# EAGLE design HVAC8New (EAGLE 7.2.0)
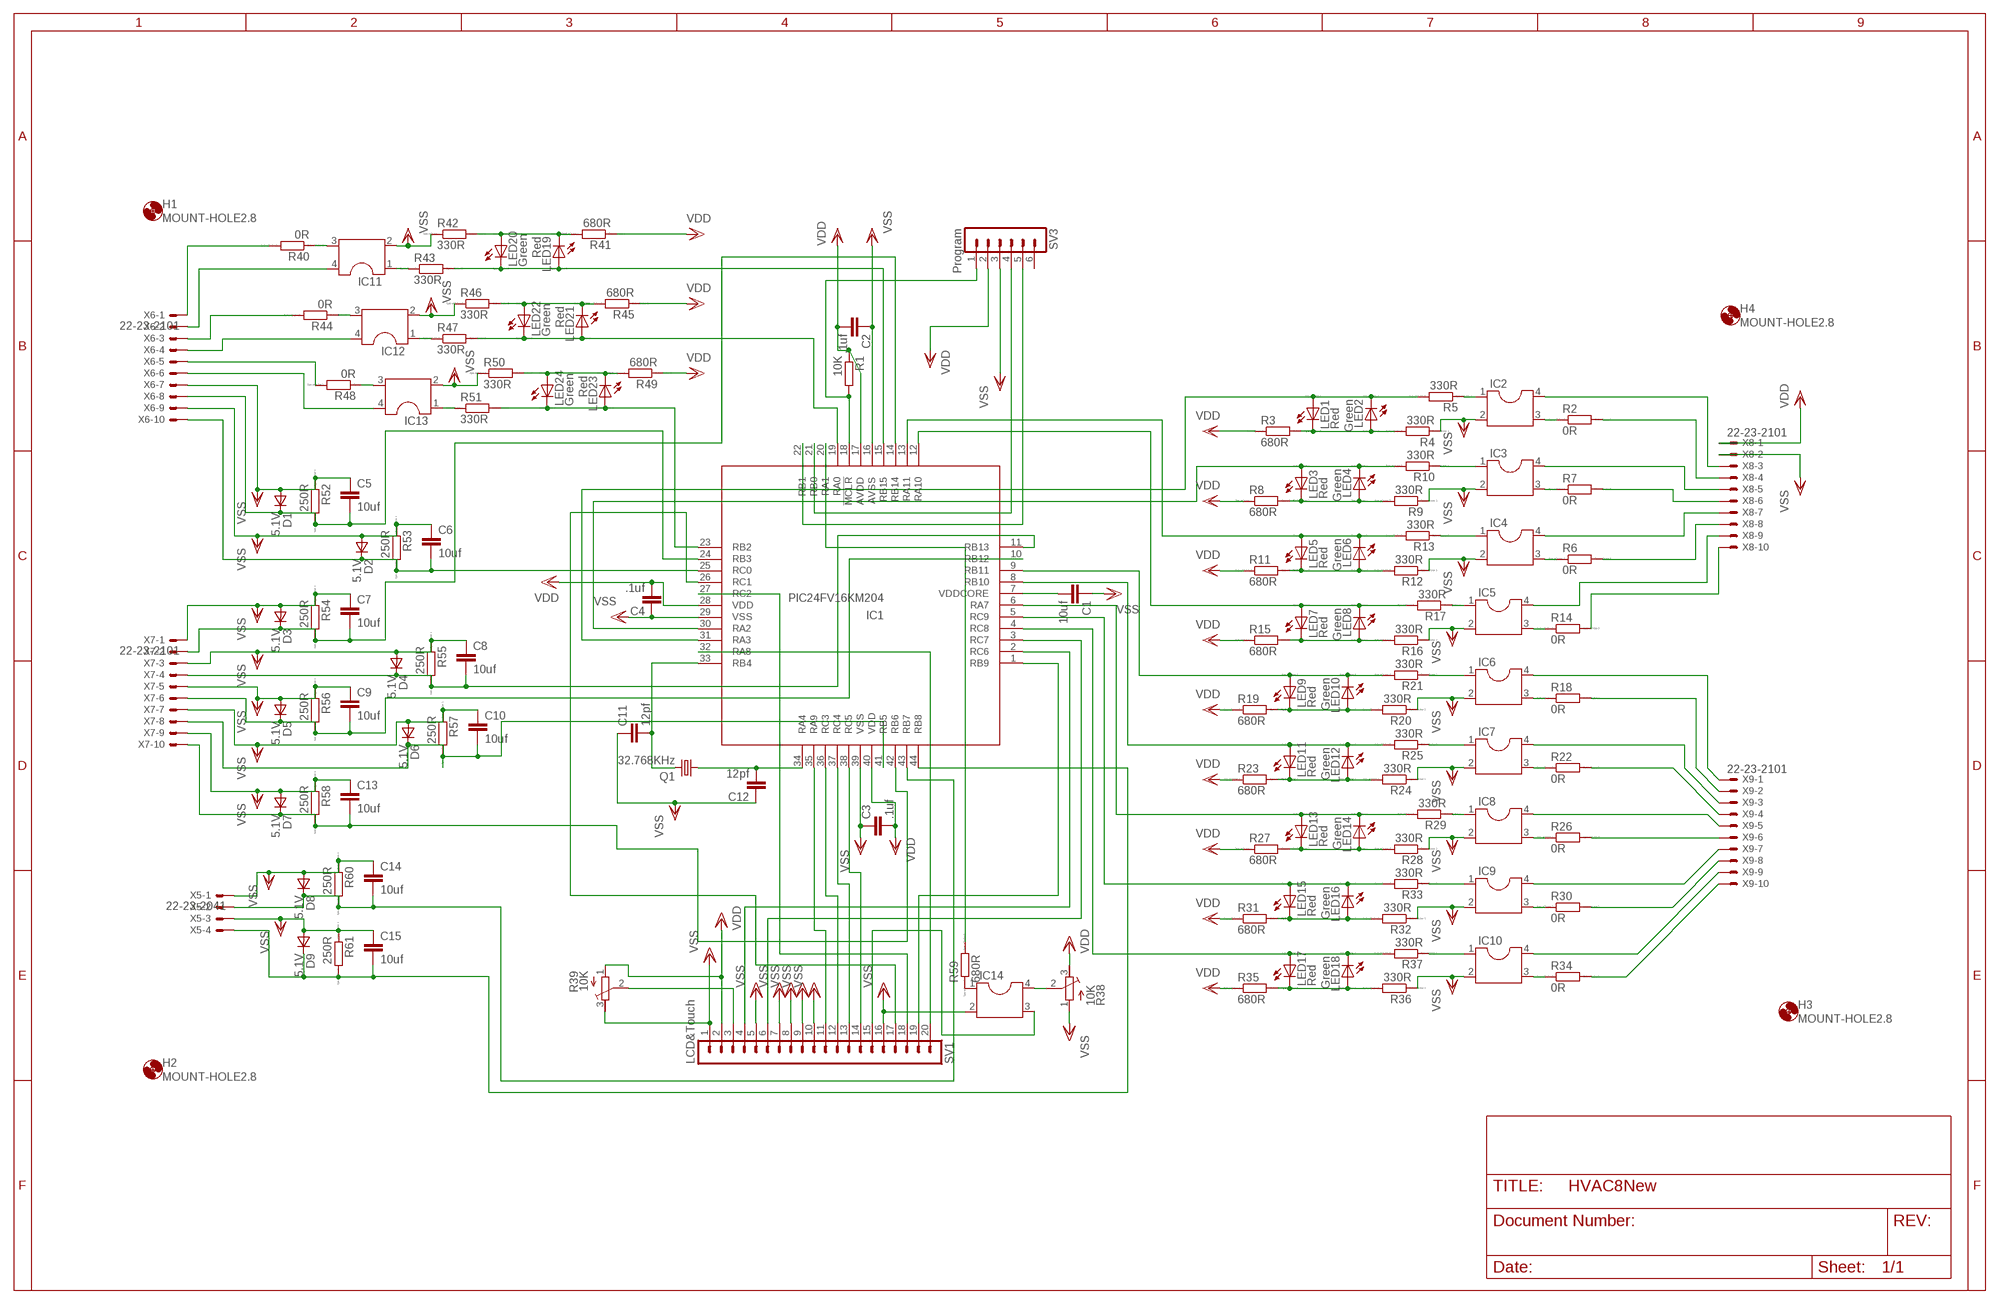
[diagram p0: schematic, sheet 1]

## Parts
C1  10uf  C-EUC1206  [C1206]
C2  .1uf  C-EUC1206  [C1206]
C3  .1uf  C-EUC1206  [C1206]
C4  .1uf  C-EUC1206  [C1206]
C5  10uf  C-EUC1206  [C1206]
C6  10uf  C-EUC1206  [C1206]
C7  10uf  C-EUC1206  [C1206]
C8  10uf  C-EUC1206  [C1206]
C9  10uf  C-EUC1206  [C1206]
C10  10uf  C-EUC1206  [C1206]
C11  12pf  C-EUC0603  [C0603]
C12  12pf  C-EUC0603  [C0603]
C13  10uf  C-EUC1206  [C1206]
C14  10uf  C-EUC1206  [C1206]
C15  10uf  C-EUC1206  [C1206]
D1  5.1V  DSOD323  [SOD323]
D2  5.1V  DSOD323  [SOD323]
D3  5.1V  DSOD323  [SOD323]
D4  5.1V  DSOD323  [SOD323]
D5  5.1V  DSOD323  [SOD323]
D6  5.1V  DSOD323  [SOD323]
D7  5.1V  DSOD323  [SOD323]
D8  5.1V  DSOD323  [SOD323]
D9  5.1V  DSOD323  [SOD323]
H1  MOUNT-HOLE2.8  [2,8]
H2  MOUNT-HOLE2.8  [2,8]
H3  MOUNT-HOLE2.8  [2,8]
H4  MOUNT-HOLE2.8  [2,8]
IC1  PIC24FV16KM204  [TQFP44]
IC2  DIL4S  [SOCKET-04]
IC3  DIL4S  [SOCKET-04]
IC4  DIL4S  [SOCKET-04]
IC5  DIL4S  [SOCKET-04]
IC6  DIL4S  [SOCKET-04]
IC7  DIL4S  [SOCKET-04]
IC8  DIL4S  [SOCKET-04]
IC9  DIL4S  [SOCKET-04]
IC10  DIL4S  [SOCKET-04]
IC11  DIL4S  [SOCKET-04]
IC12  DIL4S  [SOCKET-04]
IC13  DIL4S  [SOCKET-04]
IC14  DIL4S  [SOCKET-04]
LED1  Red  LED_E  [LED_1206]
LED2  Green  LED_E  [LED_1206]
LED3  Red  LED_E  [LED_1206]
LED4  Green  LED_E  [LED_1206]
LED5  Red  LED_E  [LED_1206]
LED6  Green  LED_E  [LED_1206]
LED7  Red  LED_E  [LED_1206]
LED8  Green  LED_E  [LED_1206]
LED9  Red  LED_E  [LED_1206]
LED10  Green  LED_E  [LED_1206]
LED11  Red  LED_E  [LED_1206]
LED12  Green  LED_E  [LED_1206]
LED13  Red  LED_E  [LED_1206]
LED14  Green  LED_E  [LED_1206]
LED15  Red  LED_E  [LED_1206]
LED16  Green  LED_E  [LED_1206]
LED17  Red  LED_E  [LED_1206]
LED18  Green  LED_E  [LED_1206]
LED19  Red  LED_E  [LED_1206]
LED20  Green  LED_E  [LED_1206]
LED21  Red  LED_E  [LED_1206]
LED22  Green  LED_E  [LED_1206]
LED23  Red  LED_E  [LED_1206]
LED24  Green  LED_E  [LED_1206]
Q1  32.768KHz  CRYSTALTC26H  [TC26H]
R1  10K  R-EU_R1206  [R1206]
R2  0R  RR1206  [R1206]
R3  680R  RR1206  [R1206]
R4  330R  RR1206  [R1206]
R5  330R  RR1206  [R1206]
R6  0R  RR1206  [R1206]
R7  0R  RR1206  [R1206]
R8  680R  RR1206  [R1206]
R9  330R  RR1206  [R1206]
R10  330R  RR1206  [R1206]
R11  680R  RR1206  [R1206]
R12  330R  RR1206  [R1206]
R13  330R  RR1206  [R1206]
R14  0R  RR1206  [R1206]
R15  680R  RR1206  [R1206]
R16  330R  RR1206  [R1206]
R17  330R  RR1206  [R1206]
R18  0R  RR1206  [R1206]
R19  680R  RR1206  [R1206]
R20  330R  RR1206  [R1206]
R21  330R  RR1206  [R1206]
R22  0R  RR1206  [R1206]
R23  680R  RR1206  [R1206]
R24  330R  RR1206  [R1206]
R25  330R  RR1206  [R1206]
R26  0R  RR1206  [R1206]
R27  680R  RR1206  [R1206]
R28  330R  RR1206  [R1206]
R29  330R  RR1206  [R1206]
R30  0R  RR1206  [R1206]
R31  680R  RR1206  [R1206]
R32  330R  RR1206  [R1206]
R33  330R  RR1206  [R1206]
R34  0R  RR1206  [R1206]
R35  680R  RR1206  [R1206]
R36  330R  RR1206  [R1206]
R37  330R  RR1206  [R1206]
R38  10K  R-TRIMM3296W  [RTRIM3296W]
R39  10K  R-TRIMM3296W  [RTRIM3296W]
R40  0R  RR1206  [R1206]
R41  680R  RR1206  [R1206]
R42  330R  RR1206  [R1206]
R43  330R  RR1206  [R1206]
R44  0R  RR1206  [R1206]
R45  680R  RR1206  [R1206]
R46  330R  RR1206  [R1206]
R47  330R  RR1206  [R1206]
R48  0R  RR1206  [R1206]
R49  680R  RR1206  [R1206]
R50  330R  RR1206  [R1206]
R51  330R  RR1206  [R1206]
R52  250R  RR1206  [R1206]
R53  250R  RR1206  [R1206]
R54  250R  RR1206  [R1206]
R55  250R  RR1206  [R1206]
R56  250R  RR1206  [R1206]
R57  250R  RR1206  [R1206]
R58  250R  RR1206  [R1206]
R59  680R  RR1206  [R1206]
R60  250R  RR1206  [R1206]
R61  250R  RR1206  [R1206]
SV1  LCD&Touch  MA20-1  [MA20-1]
SV3  Program  MA06-1  [MA06-1]
X5  22-23-2041  [22-23-2041]
X6  22-23-2101  [22-23-2101]
X7  22-23-2101  [22-23-2101]
X8  22-23-2101  [22-23-2101]
X9  22-23-2101  [22-23-2101]

## Nets
N$1: IC13.1 R51.1
N$2: IC1.18(!MCLR) R1.2 SV3.1
N$3: IC2.1 R5.1
N$4: IC1.12(RA10) LED7.A LED8.C R17.2
N$5: IC2.4 X8.3
N$6: LED1.C LED2.A R3.2 R4.2
N$7: IC2.3 R2.1
N$8: IC3.1 R10.1
N$9: R2.2 X8.4
N$10: IC3.4 X8.5
N$11: LED3.C LED4.A R8.2 R9.2
N$12: IC3.3 R7.1
N$13: IC11.1 R43.1
N$14: R7.2 X8.6
N$15: IC4.1 R13.1
N$16: LED5.C LED6.A R11.2 R12.2
N$17: IC4.3 R6.1
N$18: LED19.C LED20.A R41.2 R42.2
N$19: R14.2 X8.10
N$20: IC5.4 X8.9
N$21: IC5.1 R17.1
N$22: LED7.C LED8.A R15.2 R16.2
N$23: IC5.3 R14.1
N$24: IC6.1 R21.1
N$25: LED9.C LED10.A R19.2 R20.2
N$26: IC6.3 R18.1
N$27: R6.2 X8.8
N$28: IC4.4 X8.7
N$29: IC11.3 R40.1
N$30: IC6.4 X9.1
N$31: R18.2 X9.2
N$32: IC12.1 R47.1
N$33: IC7.1 R25.1
N$34: LED11.C LED12.A R23.2 R24.2
N$35: IC7.3 R22.1
N$36: IC1.9(RB11) LED9.A LED10.C R21.2
N$37: IC7.4 X9.3
N$38: R22.2 X9.4
N$39: IC8.1 R29.1
N$40: LED13.C LED14.A R27.2 R28.2
N$41: IC8.3 R26.1
N$42: IC9.1 R33.1
N$43: LED15.C LED16.A R31.2 R32.2
N$44: IC9.3 R30.1
N$45: IC1.5(RC9) LED15.A LED16.C R33.2
N$46: IC1.15(RB15) LED19.A LED20.C R43.2
N$47: IC10.1 R37.1
N$48: LED17.C LED18.A R35.2 R36.2
N$49: IC10.3 R34.1
N$50: IC1.4(RC8) LED17.A LED18.C R37.2
N$51: IC8.4 X9.5
N$52: R26.2 X9.6
N$53: IC9.4 X9.7
N$54: R30.2 X9.8
N$55: IC10.4 X9.9
N$56: R34.2 X9.10
N$57: LED21.C LED22.A R45.2 R46.2
N$58: IC12.3 R44.1
N$59: IC1.19(RA0) LED21.A LED22.C R47.2
N$60: R40.2 X6.1
N$61: IC1.6(RA7) LED13.A LED14.C R29.2
N$62: IC11.4 X6.2
N$63: R39.2(S) SV1.3
N$64: R44.2 X6.3
N$65: IC12.4 X6.4
N$66: IC1.3(RC7) SV1.6
N$67: IC1.8(RB10) LED11.A LED12.C R25.2
N$68: IC1.2(RC6) SV1.4
N$69: IC1.31(RA3) LED1.A LED2.C R5.2
N$70: IC1.13(RA11) LED5.A LED6.C R13.2
N$71: IC1.30(RA2) LED3.A LED4.C R10.2
N$72: IC1.35(RA9) SV1.11
N$73: IC1.36(RC3) SV1.12
N$74: IC1.37(RC4) SV1.13
N$75: IC1.38(RC5) SV1.14
N$76: IC14.3 SV1.15
N$77: LED23.C LED24.A R49.2 R50.2
N$78: IC13.3 R48.1
N$79: IC1.23(RB2) LED23.A LED24.C R51.2
N$80: R48.2 X6.5
N$81: IC13.4 X6.6
N$82: IC14.4 R38.2(S)
N$83: C5.2 D1.1(C) IC1.24(RB3) R52.2 X6.8
N$84: IC1.26(RC1) SV1.17
N$85: C6.2 D2.1(C) IC1.25(RC0) R53.2 X6.10
N$86: IC1.27(RC2) SV1.18
N$87: C7.2 D3.1(C) IC1.14(RB14) R54.2 X7.2
N$88: IC1.1(RB9) SV1.19
N$89: C8.2 D4.1(C) IC1.11(RB13) R55.2 X7.4
N$90: IC1.32(RA8) SV1.20
N$91: IC1.22(RB1) SV3.5
N$92: C9.2 D5.1(C) IC1.10(RB12) R56.2 X7.6
N$93: C10.2 D6.1(C) IC1.41(RB5) R57.2 X7.8
N$94: IC1.21(RB0) SV3.4
N$95: C12.2 IC1.34(RA4) Q1.1
N$96: C11.2 IC1.33(RB4) Q1.2
N$97: C13.2 D7.1(C) IC1.42(RB6) R58.2 X7.10
N$98: IC14.1 R59.1
N$99: IC1.20(RA1) R59.2
N$101: C14.2 D8.1(C) IC1.43(RB7) R60.2 X5.2
N$103: C15.2 D9.1(C) IC1.44(RB8) R61.2 X5.4
VDD: C2.2 C3.2 C4.2 IC1.17(AVDD) IC1.28(VDD) IC1.40(VDD) R1.1 R3.1 R8.1 R11.1 R15.1 R19.1 R23.1 R27.1 R31.1 R35.1 R38.3(E) R39.1(A) R41.1 R45.1 R49.1 SV1.2 SV3.2 X8.1
VDDCORENET: C1.2 IC1.7(VDDCORE)
VSS: C1.1 C2.1 C3.1 C4.1 C5.1 C6.1 C7.1 C8.1 C9.1 C10.1 C11.1 C12.1 C13.1 C14.1 C15.1 D1.2(A) D2.2(A) D3.2(A) D4.2(A) D5.2(A) D6.2(A) D7.2(A) D8.2(A) D9.2(A) IC1.16(AVSS) IC1.29(VSS) IC1.39(VSS) IC2.2 IC3.2 IC4.2 IC5.2 IC6.2 IC7.2 IC8.2 IC9.2 IC10.2 IC11.2 IC12.2 IC13.2 IC14.2 R4.1 R9.1 R12.1 R16.1 R20.1 R24.1 R28.1 R32.1 R36.1 R38.1(A) R39.3(E) R42.1 R46.1 R50.1 R52.1 R53.1 R54.1 R55.1 R56.1 R57.1 R58.1 R60.1 R61.1 SV1.1 SV1.5 SV1.7 SV1.8 SV1.9 SV1.10 SV1.16 SV3.3 X5.1 X5.3 X6.7 X6.9 X7.1 X7.3 X7.5 X7.7 X7.9 X8.2
Unconnected: SV3.6

## Library data of the parts
C1-C15 = rcl:C-EU: CAPACITOR, European symbol
D1-D9 = zetex:D: DIODE; MPN: CDSOD323-T05C; OC_FARNELL: 1824860; OC_NEWARK: 79R6078
H1-H4 = holes:MOUNT-HOLE: MOUNTING HOLE with drill center marker
IC1 = microchip:PIC24FV16KM204: PIC24FV16KM204 TQFP-44 Auto generated by make-symbol-device-package-bsdl.ulp Rev. 25 Edited by Dave Source: PIC24FJ64GA004.bsd; MPN: PIC24FV16KM204; OC_FARNELL: 1332299; OC_NEWARK: 98M1927
IC2-IC14 = ic-package:DIL4: Dual In Line / Socket
LED1-LED24 = eagle-ltspice:LED_E: LED Source: http://www.osram.convergy.de Source: www.luxeon.com Source: www.kingbright.com; SPICEMODEL: NONE; SPICEPREFIX: D; SPICETYPE: diode
Q1 = crystal:CRYSTAL: CRYSTAL; OC_FARNELL: unknown; OC_NEWARK: unknown
R1 = rcl:R-EU_: RESISTOR, European symbol
R2-R37 R40-R61 = eagle-ltspice:R: RESISTOR, European symbol; SPICEMODEL: NONE; SPICEPREFIX: R
R38 R39 = rcl:R-TRIMM: Trimm resistor
SV1 = con-lstb:MA20-1: PIN HEADER; OC_FARNELL: unknown; OC_NEWARK: unknown
SV3 = con-lstb:MA06-1: PIN HEADER; OC_FARNELL: unknown; OC_NEWARK: unknown
X5 = con-molex:22-23-2041: .100" (2.54mm) Center Header - 4 Pin; MF: MOLEX; MPN: 22-23-2041; OC_FARNELL: 1462920; OC_NEWARK: 38C0355
X6-X9 = con-molex:22-23-2101: .100" (2.54mm) Center Header - 10 Pin; MF: MOLEX; MPN: 22-23-2101; OC_FARNELL: 1756828; OC_NEWARK: 94C0765

## Board
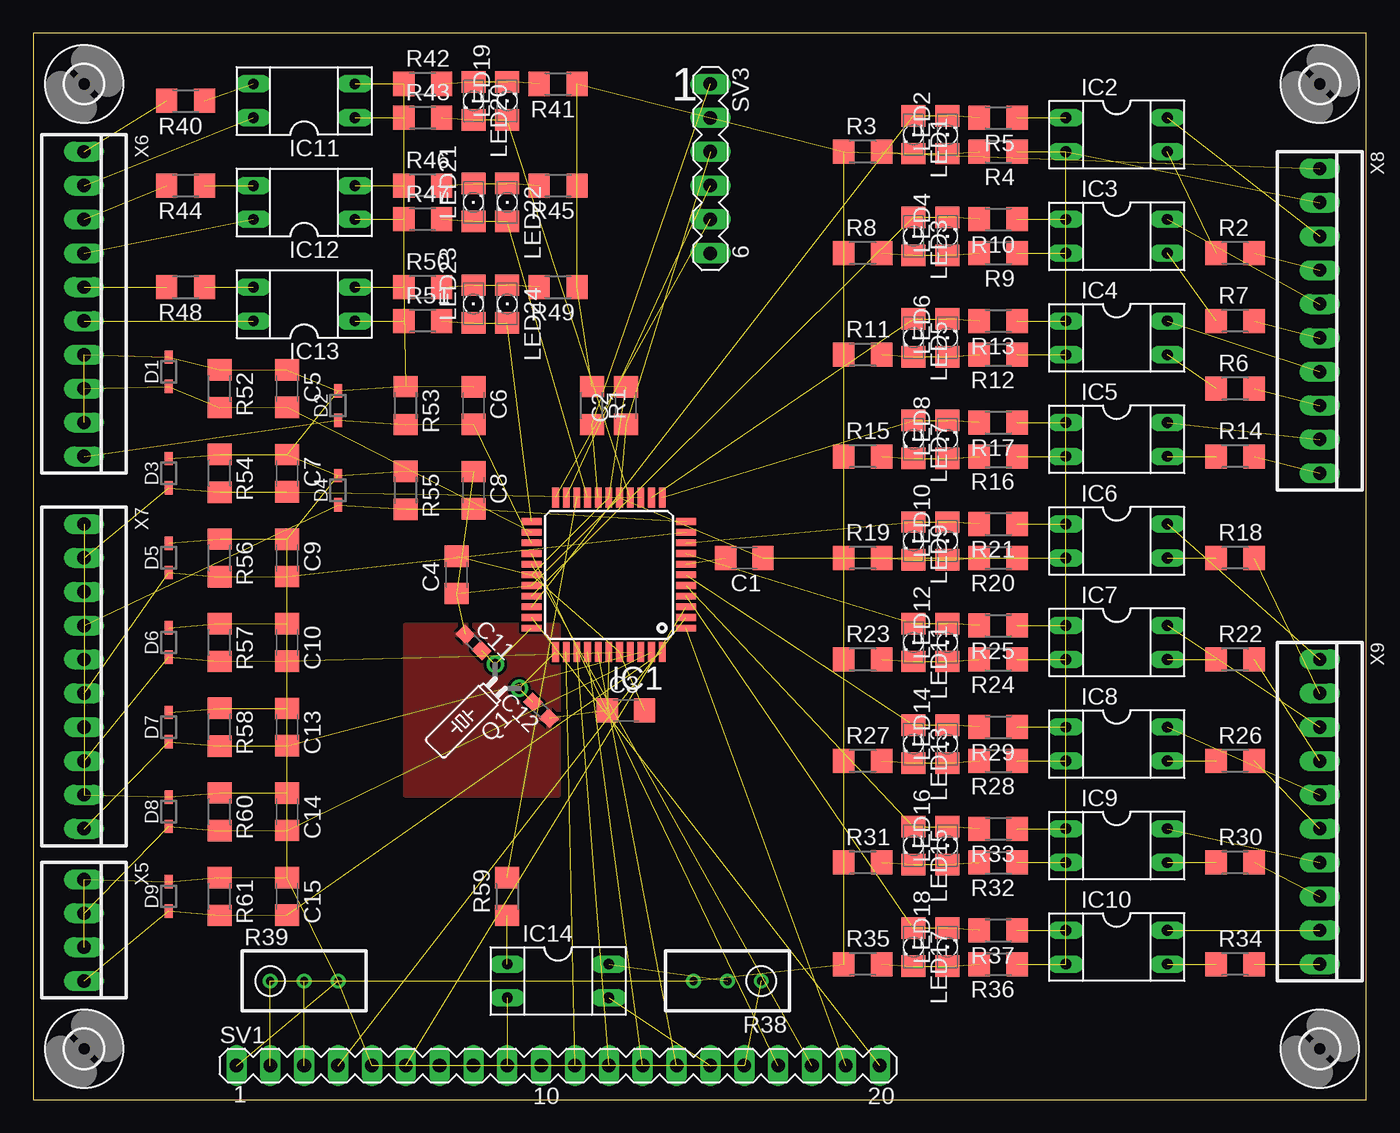
[diagram p1: board, top side]
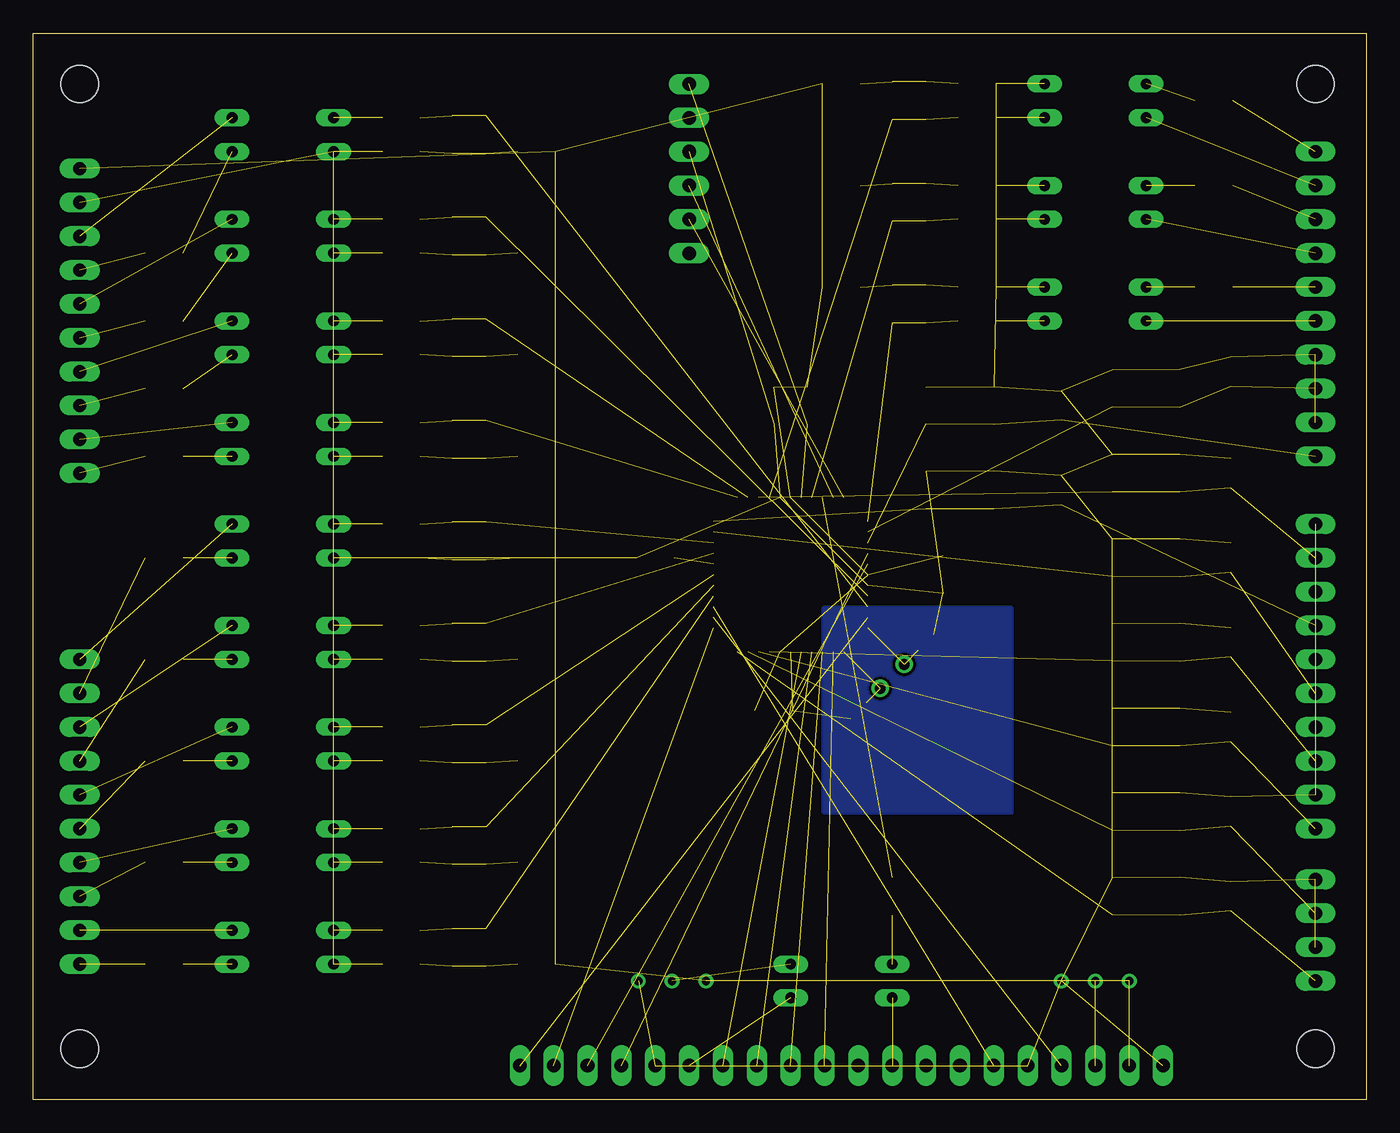
[diagram p2: board, bottom side, seen from below]

Size 100 x 80 mm. Coordinates in mm from the lower left corner, seen from the top.
Outline: 0,0 100,0 100,80 0,80 0,0
Copper layers (1*16): Top 0.035mm / dielectric 1.5mm / Bottom 0.035mm
Design rules "default *": minimum track width 10mil, minimum drill 24mil, track to track 8mil, track to pad 8mil, pad to pad 8mil, via to via 8mil, smd to smd 8mil, copper to edge 40mil, drill to drill 8mil, minimum pad ring 10mil, minimum via ring 8mil, stop-mask expansion 4mil, vias tented up to drill 0mil, thermal gap 10mil

### Footprints (pad centres in the part's own frame; a part is rotated, then mirrored left to right if it is on the bottom)
C1206 = smd 1.6 x 1.8: 1 -1.4,0; 2 1.4,0
C0603 = smd 1.1 x 1: 1 -0.85,0; 2 0.85,0
SOD323 = smd 1 x 0.6: 1 -1.1,0; 2 1.1,0
2,8 = hole 2.8: 0,0
TQFP44 = smd 1.5 x 0.5: 1 -5.8,4; 2 -5.8,3.2; 3 -5.8,2.4; 4 -5.8,1.6; 5 -5.8,0.8; 6 -5.8,0; 7 -5.8,-0.8; 8 -5.8,-1.6; 9 -5.8,-2.4; 10 -5.8,-3.2; 11 -5.8,-4; 23 5.8,-4; 24 5.8,-3.2; 25 5.8,-2.4; 26 5.8,-1.6; 27 5.8,-0.8; 28 5.8,0; 29 5.8,0.8; 30 5.8,1.6; 31 5.8,2.4; 32 5.8,3.2; 33 5.8,4 | smd 0.5 x 1.5: 12 -4,-5.8; 13 -3.2,-5.8; 14 -2.4,-5.8; 15 -1.6,-5.8; 16 -0.8,-5.8; 17 0,-5.8; 18 0.8,-5.8; 19 1.6,-5.8; 20 2.4,-5.8; 21 3.2,-5.8; 22 4,-5.8; 34 4,5.8; 35 3.2,5.8; 36 2.4,5.8; 37 1.6,5.8; 38 0.8,5.8; 39 0,5.8; 40 -0.8,5.8; 41 -1.6,5.8; 42 -2.4,5.8; 43 -3.2,5.8; 44 -4,5.8
SOCKET-04 = drill 0.813 long: 1 -1.27,-3.81; 2 1.27,-3.81; 3 1.27,3.81; 4 -1.27,3.81
LED_1206 = smd 1.6 x 1.803: A -1.422,0; C 1.422,0
TC26H = drill 0.813: 1 -1.27,0; 2 1.27,0
R1206 = smd 1.6 x 1.803: 1 -1.422,0; 2 1.422,0
RTRIM3296W = drill 0.61: 1 0,-2.54; 2 0,0; 3 0,2.54
MA20-1 = drill 1.016 long: 1 -24.13,0; 2 -21.59,0; 3 -19.05,0; 4 -16.51,0; 5 -13.97,0; 6 -11.43,0; 7 -8.89,0; 8 -6.35,0; 9 -3.81,0; 10 -1.27,0; 11 1.27,0; 12 3.81,0; 13 6.35,0; 14 8.89,0; 15 11.43,0; 16 13.97,0; 17 16.51,0; 18 19.05,0; 19 21.59,0; 20 24.13,0
MA06-1 = drill 1.016 long: 1 -6.35,0; 2 -3.81,0; 3 -1.27,0; 4 1.27,0; 5 3.81,0; 6 6.35,0
22-23-2041 = drill 1 long: 1 -3.81,0; 2 -1.27,0; 3 1.27,0; 4 3.81,0
22-23-2101 = drill 1 long: 1 -11.43,0; 2 -8.89,0; 3 -6.35,0; 4 -3.81,0; 5 -1.27,0; 6 1.27,0; 7 3.81,0; 8 6.35,0; 9 8.89,0; 10 11.43,0

### Placement (x,y rotation side)
C1  53.34,40.64 180 top
C2  44.45,52.07 90 top
C3  44.45,29.21 0 top
C4  31.75,39.37 90 top
C5  19.05,53.34 270 top
C6  33.02,52.07 270 top
C7  19.05,46.99 270 top
C8  33.02,45.72 270 top
C9  19.05,40.64 270 top
C10  19.05,34.29 270 top
C11  33.02,34.29 315 top
C12  38.1,29.21 135 top
C13  19.05,27.94 270 top
C14  19.05,21.59 270 top
C15  19.05,15.24 270 top
D1  10.16,54.61 90 top
D2  22.86,52.07 90 top
D3  10.16,46.99 90 top
D4  22.86,45.72 90 top
D5  10.16,40.64 90 top
D6  10.16,34.29 90 top
D7  10.16,27.94 90 top
D8  10.16,21.59 90 top
D9  10.16,15.24 90 top
H1  3.81,3.81 0 top
H2  96.52,3.81 0 top
H3  96.52,76.2 0 top
H4  3.81,76.2 0 top
IC1  43.18,39.37 180 top
IC2  81.28,72.39 270 top
IC3  81.28,64.77 270 top
IC4  81.28,57.15 270 top
IC5  81.28,49.53 270 top
IC6  81.28,41.91 270 top
IC7  81.28,34.29 270 top
IC8  81.28,26.67 270 top
IC9  81.28,19.05 270 top
IC10  81.28,11.43 270 top
IC11  20.32,74.93 90 top
IC12  20.32,67.31 90 top
IC13  20.32,59.69 90 top
IC14  39.37,8.89 270 top
LED1  66.04,72.39 270 top
LED2  68.58,72.39 90 top
LED3  66.04,64.77 270 top
LED4  68.58,64.77 90 top
LED5  66.04,57.15 270 top
LED6  68.58,57.15 90 top
LED7  66.04,49.53 270 top
LED8  68.58,49.53 90 top
LED9  66.04,41.91 270 top
LED10  68.58,41.91 90 top
LED11  66.04,34.29 270 top
LED12  68.58,34.29 90 top
LED13  66.04,26.67 270 top
LED14  68.58,26.67 90 top
LED15  66.04,19.05 270 top
LED16  68.58,19.05 90 top
LED17  66.04,11.43 270 top
LED18  68.58,11.43 90 top
LED19  35.56,74.93 90 top
LED20  33.02,74.93 270 top
LED21  33.02,67.31 90 top
LED22  35.56,67.31 270 top
LED23  33.02,59.69 90 top
LED24  35.56,59.69 270 top
Q1  35.56,31.75 135 top
R1  41.91,52.07 270 top
R2  90.17,63.5 0 top
R3  62.23,71.12 0 top
R4  72.39,71.12 180 top
R5  72.39,73.66 180 top
R6  90.17,53.34 0 top
R7  90.17,58.42 0 top
R8  62.23,63.5 0 top
R9  72.39,63.5 180 top
R10  72.39,66.04 180 top
R11  62.23,55.88 0 top
R12  72.39,55.88 180 top
R13  72.39,58.42 180 top
R14  90.17,48.26 0 top
R15  62.23,48.26 0 top
R16  72.39,48.26 180 top
R17  72.39,50.8 180 top
R18  90.17,40.64 0 top
R19  62.23,40.64 0 top
R20  72.39,40.64 180 top
R21  72.39,43.18 180 top
R22  90.17,33.02 0 top
R23  62.23,33.02 0 top
R24  72.39,33.02 180 top
R25  72.39,35.56 180 top
R26  90.17,25.4 0 top
R27  62.23,25.4 0 top
R28  72.39,25.4 180 top
R29  72.39,27.94 180 top
R30  90.17,17.78 0 top
R31  62.23,17.78 0 top
R32  72.39,17.78 180 top
R33  72.39,20.32 180 top
R34  90.17,10.16 0 top
R35  62.23,10.16 0 top
R36  72.39,10.16 180 top
R37  72.39,12.7 180 top
R38  52.07,8.89 90 top
R39  20.32,8.89 270 top
R40  11.43,74.93 180 top
R41  39.37,76.2 180 top
R42  29.21,76.2 0 top
R43  29.21,73.66 0 top
R44  11.43,68.58 180 top
R45  39.37,68.58 180 top
R46  29.21,68.58 0 top
R47  29.21,66.04 0 top
R48  11.43,60.96 180 top
R49  39.37,60.96 180 top
R50  29.21,60.96 0 top
R51  29.21,58.42 0 top
R52  13.97,53.34 270 top
R53  27.94,52.07 270 top
R54  13.97,46.99 270 top
R55  27.94,45.72 270 top
R56  13.97,40.64 270 top
R57  13.97,34.29 270 top
R58  13.97,27.94 270 top
R59  35.56,15.24 90 top
R60  13.97,21.59 270 top
R61  13.97,15.24 270 top
SV1  39.37,2.54 0 top
SV3  50.8,69.85 270 top
X5  3.81,12.7 270 top
X6  3.81,59.69 270 top
X7  3.81,31.75 270 top
X8  96.52,58.42 270 top
X9  96.52,21.59 270 top

### Tracks (layer width: path | path; a pad name or v marks a point on that pad's centre or on a via)
N$1  (1 unrouted)
N$2  (2 unrouted)
N$3  (1 unrouted)
N$4  (3 unrouted)
N$5  (1 unrouted)
N$6  (3 unrouted)
N$7  (1 unrouted)
N$8  (1 unrouted)
N$9  (1 unrouted)
N$10  (1 unrouted)
N$11  (3 unrouted)
N$12  (1 unrouted)
N$13  (1 unrouted)
N$14  (1 unrouted)
N$15  (1 unrouted)
N$16  (3 unrouted)
N$17  (1 unrouted)
N$18  (3 unrouted)
N$19  (1 unrouted)
N$20  (1 unrouted)
N$21  (1 unrouted)
N$22  (3 unrouted)
N$23  (1 unrouted)
N$24  (1 unrouted)
N$25  (3 unrouted)
N$26  (1 unrouted)
N$27  (1 unrouted)
N$28  (1 unrouted)
N$29  (1 unrouted)
N$30  (1 unrouted)
N$31  (1 unrouted)
N$32  (1 unrouted)
N$33  (1 unrouted)
N$34  (3 unrouted)
N$35  (1 unrouted)
N$36  (3 unrouted)
N$37  (1 unrouted)
N$38  (1 unrouted)
N$39  (1 unrouted)
N$40  (3 unrouted)
N$41  (1 unrouted)
N$42  (1 unrouted)
N$43  (3 unrouted)
N$44  (1 unrouted)
N$45  (3 unrouted)
N$46  (3 unrouted)
N$47  (1 unrouted)
N$48  (3 unrouted)
N$49  (1 unrouted)
N$50  (3 unrouted)
N$51  (1 unrouted)
N$52  (1 unrouted)
N$53  (1 unrouted)
N$54  (1 unrouted)
N$55  (1 unrouted)
N$56  (1 unrouted)
N$57  (3 unrouted)
N$58  (1 unrouted)
N$59  (3 unrouted)
N$60  (1 unrouted)
N$61  (3 unrouted)
N$62  (1 unrouted)
N$63  (1 unrouted)
N$64  (1 unrouted)
N$65  (1 unrouted)
N$66  (1 unrouted)
N$67  (3 unrouted)
N$68  (1 unrouted)
N$69  (3 unrouted)
N$70  (3 unrouted)
N$71  (3 unrouted)
N$72  (1 unrouted)
N$73  (1 unrouted)
N$74  (1 unrouted)
N$75  (1 unrouted)
N$76  (1 unrouted)
N$77  (3 unrouted)
N$78  (1 unrouted)
N$79  (3 unrouted)
N$80  (1 unrouted)
N$81  (1 unrouted)
N$82  (1 unrouted)
N$83  (4 unrouted)
N$84  (1 unrouted)
N$85  (4 unrouted)
N$86  (1 unrouted)
N$87  (4 unrouted)
N$88  (1 unrouted)
N$89  (4 unrouted)
N$90  (1 unrouted)
N$91  (1 unrouted)
N$92  (4 unrouted)
N$93  (4 unrouted)
N$94  (1 unrouted)
N$95  (2 unrouted)
N$96  (2 unrouted)
N$97  (4 unrouted)
N$98  (1 unrouted)
N$99  (1 unrouted)
N$101  (4 unrouted)
N$103  (4 unrouted)
VDD  (23 unrouted)
VDDCORENET  (1 unrouted)
VSS  (79 unrouted)
  pour Top: 39.37,35.56 27.94,35.56 27.94,34.29 27.94,22.86 39.37,22.86
  pour Bottom: 39.37,36.83 26.67,36.83 26.67,21.59 40.64,21.59 40.64,36.83